# EAGLE design mirror-atmega8 (EAGLE 7.5.0)
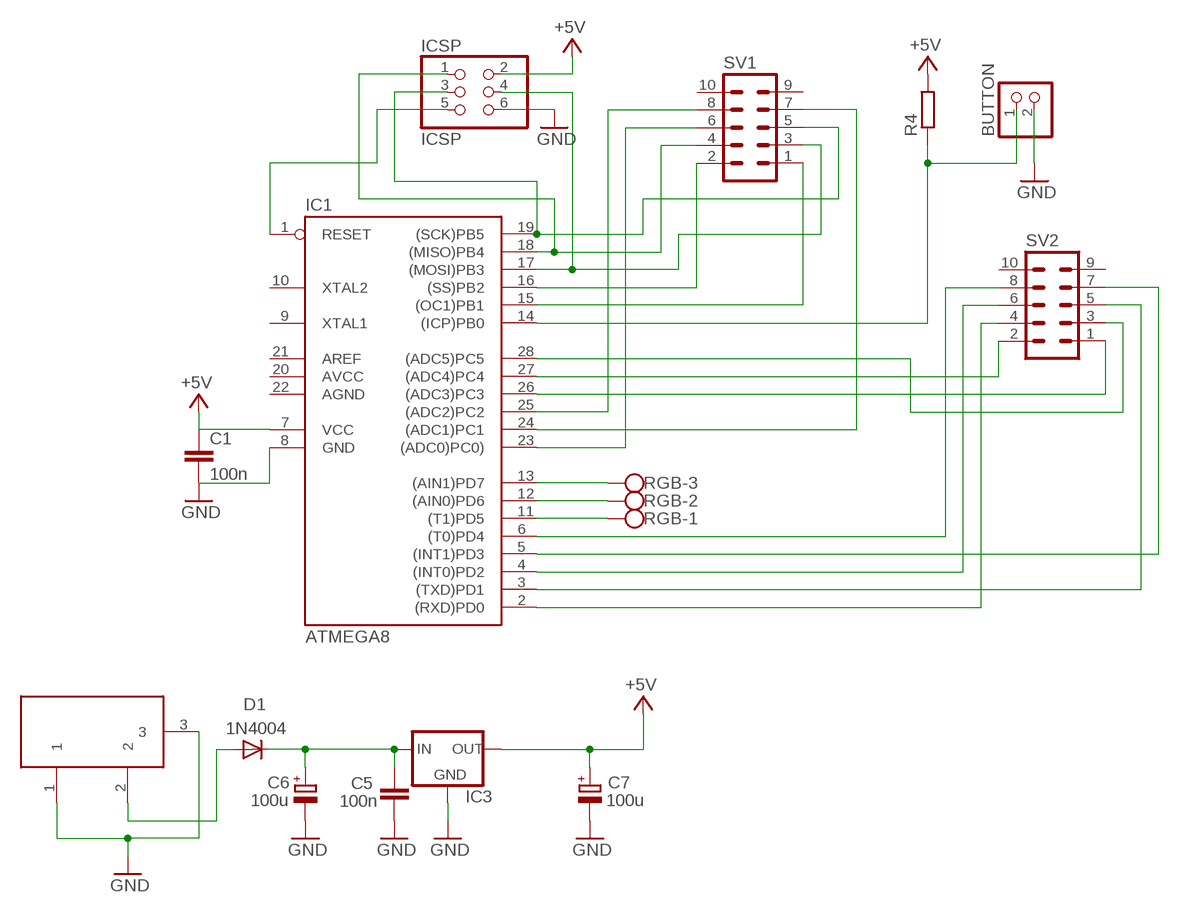
[diagram p0: schematic, sheet 1]

## Parts
BUTTON  PINHD-1X2  [1X02]
C1  100n  C-EU050-025X075  [C050-025X075]
C5  100n  C-EU050-025X075  [C050-025X075]
C6  100u  CPOL-EUE3.5-8  [E3,5-8]
C7  100u  CPOL-EUE3.5-8  [E3,5-8]
D1  1N4004  [DO41-10]
DC1  DC21MMX  [DC-21MM]
IC1  ATMEGA8  AT90S4433P  [DIL28-3]
IC3  78XXL  [78XXL]
ICSP  ICSP  PINHD-2X3  [2X03]
R4  R-EU_0204/7  [0204/7]
RGB  W237-103  [W237-103]
SV1  ML10  [ML10]
SV2  ML10  [ML10]

## Nets
+5V [power]: C1.1 C7.+ IC1.7(VCC) IC3.OUT ICSP.2 R4.2
GND [power]: BUTTON.2 C1.2 C5.1 C6.- C7.- DC1.1 DC1.3 IC1.8(GND) IC3.GND ICSP.6
N$1: IC1.18((MISO)PB4) ICSP.1 SV1.4
N$2: IC1.26((ADC3)PC3) SV2.1
N$3: IC1.25((ADC2)PC2) SV1.8
N$4: IC1.17((MOSI)PB3) ICSP.4 SV1.3
N$5: IC1.27((ADC4)PC4) SV2.2
N$6: IC1.28((ADC5)PC5) SV2.3
N$7: IC1.2((RXD)PD0) SV2.4
N$8: D1.A DC1.2
N$9: IC1.3((TXD)PD1) SV2.5
N$10: IC1.4((INT0)PD2) SV2.6
N$11: IC1.5((INT1)PD3) SV2.7
N$12: IC1.13((AIN1)PD7) RGB.3
N$13: IC1.12((AIN0)PD6) RGB.2
N$14: IC1.11((T1)PD5) RGB.1
N$16: IC1.6((T0)PD4) SV2.8
N$19: IC1.16((SS)PB2) SV1.2
N$20: BUTTON.1 IC1.14((ICP)PB0) R4.1
N$22: IC1.15((OC1)PB1) SV1.1
N$24: IC1.23((ADC0)PC0)) SV1.6
N$26: IC1.24((ADC1)PC1) SV1.7
RESET: IC1.1(RESET) ICSP.5
SCK: IC1.19((SCK)PB5) ICSP.3 SV1.5
VIN [power]: C5.2 C6.+ D1.C IC3.IN
Unconnected: IC1.9(XTAL1) IC1.10(XTAL2) SV1.9 SV1.10 SV2.9 SV2.10

## Power pins joined to a net without a drawn wire
AGND: IC1.22(AGND)
AREF: IC1.21(AREF)
AVCC: IC1.20(AVCC)

## Library data of the parts
BUTTON = -redpic-connector:PINHD-1X2: Pin Header 2
C1 C5 = rcl:C-EU: CAPACITOR, European symbol
C6 C7 = rcl:CPOL-EU: POLARIZED CAPACITOR, European symbol
D1 = diode:1N4004: DIODE general purpose rectifier, 1 A
DC1 = powersupply:DC21MM
IC1 = atmel:AT90S4433: MICROCONTROLLER 4 Kbytes FLASH 128 bytes SRAM 256 bytes EEPROM UART 6-channel 10 bit ADC
IC3 = -redpic-basic-components:78XXL: VOLTAGE REGULATOR
ICSP = pinhead:PINHD-2X3: PIN HEADER
R4 = rcl:R-EU_: RESISTOR, European symbol
RGB = con-wago-500:W237-103: WAGO SCREW CLAMP
SV1 SV2 = -redpic-connector:ML10: Conector HARTING Cable Plano 10 Pins.

## Net classes
1 power: width 0.61 mm

## Board
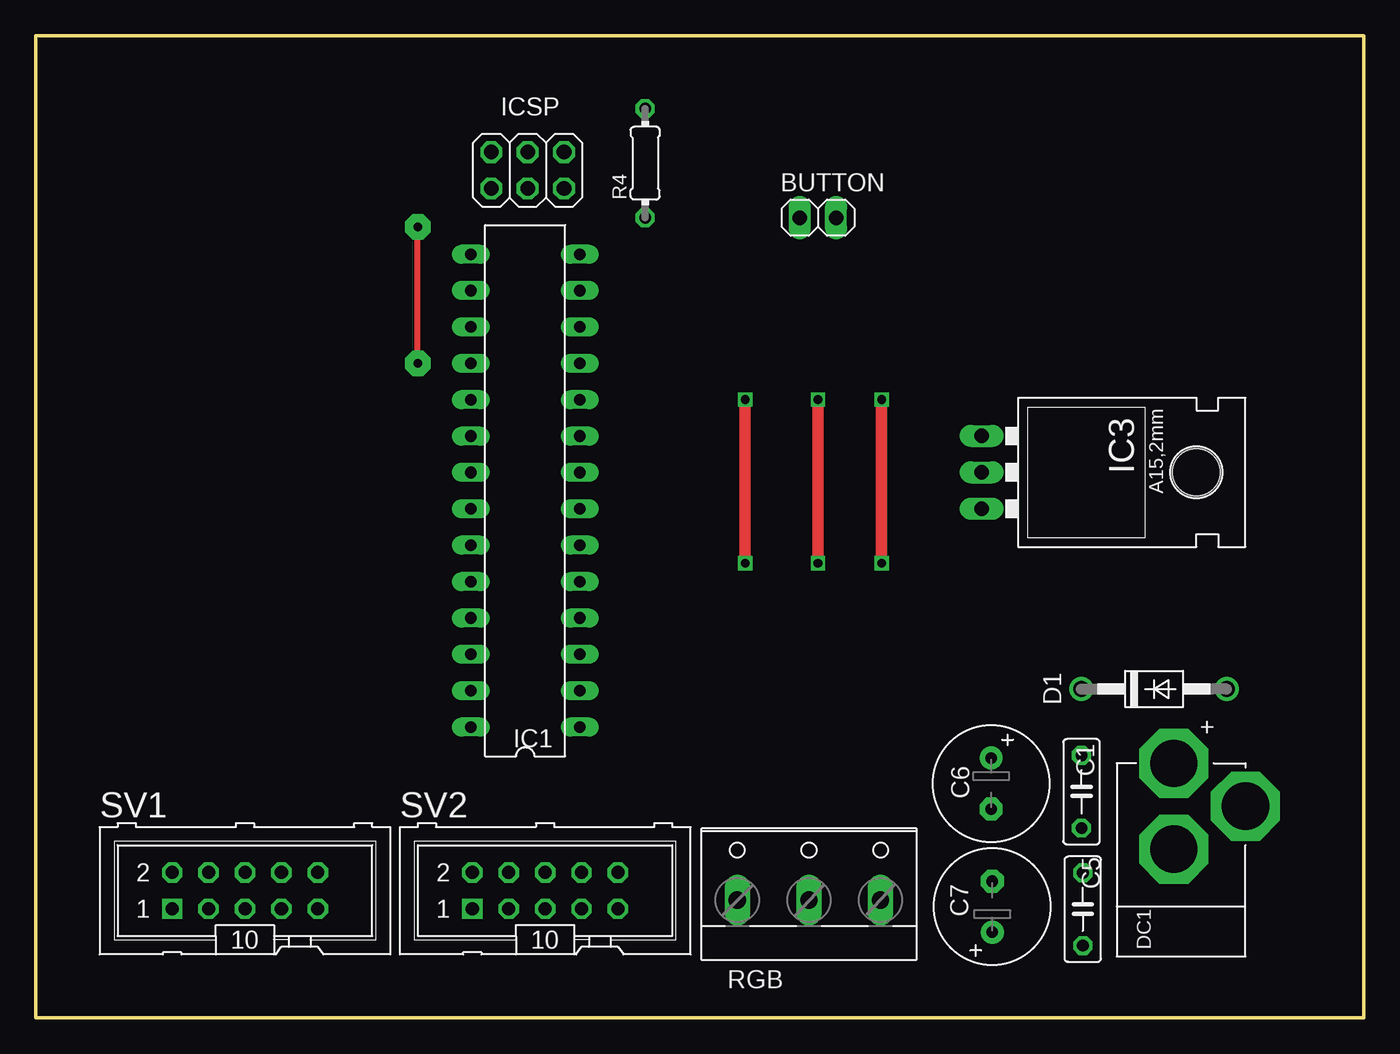
[diagram p1: board, top side]
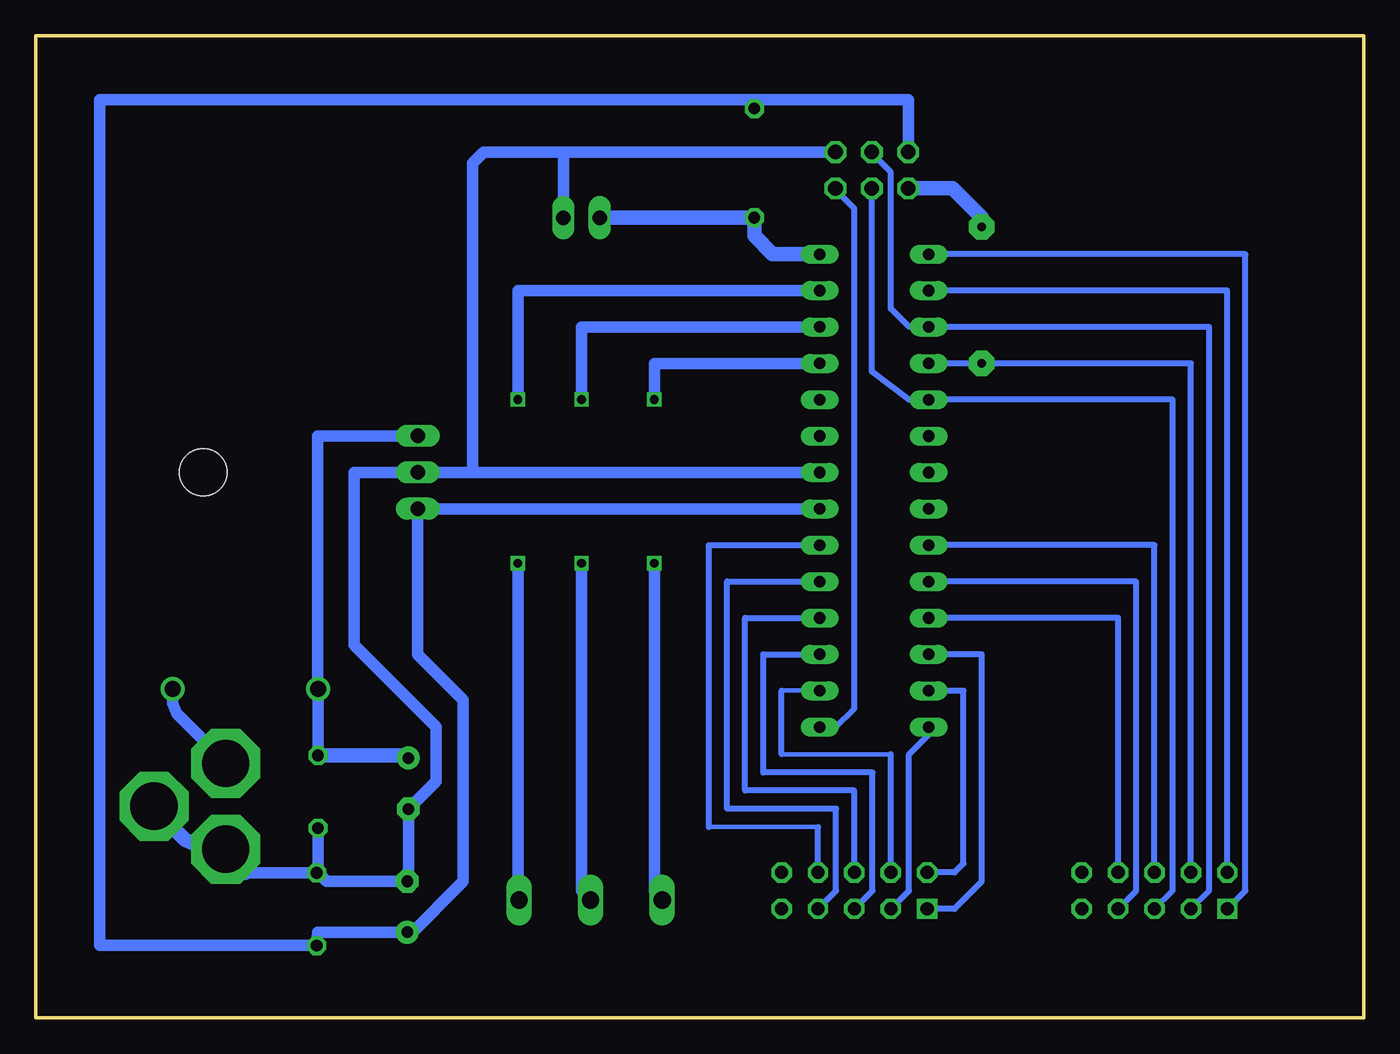
[diagram p2: board, bottom side, seen from below]

Size 92.71 x 68.58 mm. Coordinates in mm from the lower left corner, seen from the top.
Outline: 0,0 92.71,0 92.71,68.58 0,68.58 0,0
Copper layers (1*16): Top 0.035mm / dielectric 1.5mm / Bottom 0.035mm
Design rules "default": minimum track width 10mil, minimum drill 24mil, track to track 8mil, track to pad 8mil, pad to pad 8mil, via to via 8mil, smd to smd 8mil, copper to edge 40mil, drill to drill 8mil, minimum pad ring 10mil, minimum via ring 8mil, stop-mask expansion 4mil, vias tented up to drill 0mil, thermal gap 10mil

### Footprints (pad centres in the part's own frame; a part is rotated, then mirrored left to right if it is on the bottom)
1X02 = drill 1.016 long: 1 -1.27,0; 2 1.27,0
C050-025X075 = drill 0.813 octagon: 1 -2.54,0; 2 2.54,0
E3,5-8 = drill 0.813 pad 1.6: + -1.778,0 | drill 0.813 pad 1.6 octagon: - 1.778,0
DO41-10 = drill 1.118: A 5.08,0; C -5.08,0
DC-21MM = drill 3.302 pad 4.826 octagon: 1 -5.08,-3.353; 2 -0.076,-6.35; 3 -0.076,-0.356
DIL28-3 = drill 0.813 long: 1 -16.51,-3.81; 2 -13.97,-3.81; 3 -11.43,-3.81; 4 -8.89,-3.81; 5 -6.35,-3.81; 6 -3.81,-3.81; 7 -1.27,-3.81; 8 1.27,-3.81; 9 3.81,-3.81; 10 6.35,-3.81; 11 8.89,-3.81; 12 11.43,-3.81; 13 13.97,-3.81; 14 16.51,-3.81; 15 16.51,3.81; 16 13.97,3.81; 17 11.43,3.81; 18 8.89,3.81; 19 6.35,3.81; 20 3.81,3.81; 21 1.27,3.81; 22 -1.27,3.81; 23 -3.81,3.81; 24 -6.35,3.81; 25 -8.89,3.81; 26 -11.43,3.81; 27 -13.97,3.81; 28 -16.51,3.81
78XXL = drill 1.016 long: GND 0,-3.81; IN -2.54,-3.81; OUT 2.54,-3.81 | hole 3.302: 0,11.176
2X03 = drill 1.016 octagon: 1 -2.54,-1.27; 2 -2.54,1.27; 3 0,-1.27; 4 0,1.27; 5 2.54,-1.27; 6 2.54,1.27
0204/7 = drill 0.813 octagon: 1 -3.81,0; 2 3.81,0
W237-103 = drill 1.194 long: 1 -5,-1.29; 2 0,-1.29; 3 5,-1.29
ML10 = drill 0.914 pad 1.422 square: 1 -5.08,-1.27 | drill 0.914 pad 1.422 octagon: 2 -5.08,1.27; 3 -2.54,-1.27; 4 -2.54,1.27; 5 0,-1.27; 6 0,1.27; 7 2.54,-1.27; 8 2.54,1.27; 9 5.08,-1.27; 10 5.08,1.27

### Placement (x,y rotation side)
BUTTON  54.61,55.88 0 top
C1  73.1,7.59 90 top
C5  73.01,15.8 90 top
C6  66.7,16.37 270 top
C7  66.78,7.77 90 top
D1  78.07,22.96 0 top
DC1  79.38,11.43 180 top
IC1  34.17,36.82 90 top
IC3  69.85,38.1 270 top
ICSP  34.34,59.2 0 top
R4  42.55,59.69 90 top
RGB  53.98,9.53 0 top
SV1  14.61,8.89 0 top
SV2  35.56,8.89 0 top

### Tracks (layer width: path | path; a pad name or v marks a point on that pad's centre or on a via)
+5V
  Bottom 0.305: 73.03,5.08 73.05,5.05 C1.1 | 66.03,35.55 IC3.OUT | 66.67,5.71 66.78,5.82 C7.+ | 42.55,64.14 R4.2
  Bottom 0.813: C7.+ 73.03,5.99 C1.1 | ICSP.2 31.8,64.14 42.55,64.14 88.27,64.14 88.27,5.08 73.03,5.08 | IC1.7 66.03,35.55 | IC3.OUT 66.04,25.4 62.87,22.23 62.87,9.53 66.67,5.71
GND  (via drill 0.6 pad 3.81)
  Bottom 0.305: C1.2 73.05,10.13 73.03,10.16 73.01,10.18 | 79.45,11.51 DC1.3 | v84.45,14.61 DC1.1 | 66.69,9.54 66.67,9.53 | 66.69,9.54 C7.- | 66.7,9.55 66.69,9.54 | 66.03,38.09 IC3.GND | 66.69,14.59 C6.- | 51.44,38.09 51.44,38.1 | 56.52,38.09 56.52,38.1 | 60.96,38.09 60.96,38.1 | 57.01,60.47 56.02,60.47 55.88,60.33
  Bottom 0.813: C7.- 72.41,9.54 73.03,10.16 | 73.01,10.18 C5.1 | C1.2 78.08,10.13 | C6.- 66.7,9.55 | IC1.8 51.44,38.09 56.52,38.09 60.96,38.09 62.23,38.09 | 62.23,38.09 66.03,38.09 | ICSP.6 57.01,60.47 61.45,60.47 62.23,59.69 62.23,38.09 | IC3.GND 70.48,38.1 70.48,26.04 64.77,20.32 64.77,16.51 66.69,14.59 | 55.88,60.33 BUTTON.2
  Bottom 1.016: 78.08,10.13 79.45,11.51 | DC1.3 80.73,11.79 82.28,12.43 v84.45,14.61
N$1  (via drill 0.6 pad 1.78)
  Top 0.406: v26.67,45.72 v26.67,55.24
  Bottom 0.305: v26.67,55.24 26.67,55.88 | 27.94,45.71 27.94,45.72 v26.67,45.72
  Bottom 0.406: SV1.4 12.06,45.71 27.94,45.71 IC1.18
  Bottom 1.016: ICSP.1 28.71,57.92 26.67,55.88
N$2
  Bottom 0.406: IC1.26 26.67,25.39 26.67,9.53 28.57,7.62 SV2.1
N$3
  Bottom 0.305: 30.48,27.94 30.47,27.93 IC1.25
  Bottom 0.406: SV1.8 17.14,27.94 30.48,27.94
N$4
  Bottom 0.305: 34.34,60.38 ICSP.4 | 30.48,48.26 30.47,48.25 IC1.17
  Bottom 0.406: IC1.17 10.79,48.25 10.79,8.89 SV1.3 | 34.34,60.38 33.02,59.05 33.02,49.53 31.75,48.26 30.48,48.26
N$5
  Bottom 0.406: IC1.27 27.94,22.85 27.94,10.79 28.57,10.16 SV2.2
N$6
  Bottom 0.305: 30.36,19.8 IC1.28
  Bottom 0.406: 30.36,19.8 31.75,18.41 31.75,8.89 SV2.3
N$7
  Bottom 0.305: IC1.2 38.09,22.85 38.1,22.86 40.64,22.86 | 33.02,18.41 40.64,18.41
  Bottom 0.406: SV2.4 33.02,18.41 | 40.64,18.41 40.64,22.86
N$8  (via drill 0.6 pad 3.81)
  Bottom 0.305: DC1.2 v79.38,17.78
  Bottom 0.813: v79.38,17.78 82.87,21.28 83.15,21.95 D1.A
N$9
  Bottom 0.305: 38.1,25.4 38.09,25.39 IC1.3
  Bottom 0.406: SV2.5 34.29,8.89 34.29,17.14 41.91,17.14 41.91,25.4 38.1,25.4
N$10
  Bottom 0.305: 39.38,27.93 IC1.4
  Bottom 0.406: 39.38,27.93 43.18,27.94 43.18,15.88 35.56,15.88 SV2.6
N$11
  Bottom 0.305: IC1.5 38.09,30.47 38.1,30.48 37.47,30.48
  Bottom 0.406: SV2.7 36.83,8.89 36.83,14.61 44.45,14.61 44.45,30.48 38.1,30.48
N$12  (via drill 0.6)
  Top 0.813: v59.05,43.18 v59.05,31.75
  Bottom 0.813: IC1.13 59.05,50.79 v59.05,43.18 | RGB.3 59.05,8.23 v59.05,31.75
N$13  (via drill 0.6)
  Top 0.813: v54.61,43.18 v54.61,31.75
  Bottom 0.813: IC1.12 54.61,48.25 v54.61,43.18 | RGB.2 53.98,8.26 54.61,8.89 v54.61,31.75
N$14  (via drill 0.6)
  Top 0.813: v49.53,43.18 v49.53,31.75
  Bottom 0.813: IC1.11 49.53,45.71 v49.53,43.18 | RGB.1 48.91,8.23 48.9,8.26 49.53,8.89 v49.53,31.75
N$16
  Bottom 0.305: 38.1,13.34 45.72,13.34
  Bottom 0.406: IC1.6 40.02,33.01 45.72,33.02 45.72,13.34 | SV2.8 38.1,13.34
N$19
  Bottom 0.305: 30.48,50.8 30.47,50.79 IC1.16
  Bottom 0.406: SV1.2 9.53,50.8 30.48,50.8
N$20
  Bottom 0.305: 52.7,55.88 BUTTON.1
  Bottom 1.016: 52.7,55.88 R4.1 42.55,54.61 41.26,53.33 IC1.14
N$21  (via drill 0.6 pad 3.81)
  other vias: 79.38,12.06
N$22
  Bottom 0.406: IC1.15 8.26,53.33 8.26,8.89 SV1.1
N$24
  Bottom 0.406: SV1.6 14.61,33.01 IC1.23
N$26
  Bottom 0.406: SV1.7 15.88,8.89 15.88,30.47 IC1.24
RESET
  Bottom 0.305: 36.88,57.84 ICSP.5 | IC1.1 38.09,20.31 38.1,20.32 36.83,20.32
  Bottom 0.406: 36.88,57.84 35.56,56.52 35.56,21.59 36.83,20.32
SCK
  Bottom 0.305: 30.48,43.18 30.47,43.17 IC1.19
  Bottom 0.406: ICSP.3 34.34,45.13 31.75,43.18 30.48,43.18 13.34,43.18 13.34,8.89 SV1.5
VIN
  Bottom 0.305: C5.2 73.01,18.4 73.03,18.41 72.99,18.45 | 66.7,18.39 66.67,18.41 | C6.+ 66.7,18.39 | 66.7,18.39 66.75,18.34 | 73.03,22.86 72.99,22.9 D1.C
  Bottom 0.813: 72.99,18.45 D1.C | IC3.IN 73.03,40.64 73.03,22.86
  Bottom 1.016: 66.75,18.34 C5.2

### Text on the board
tNames: +